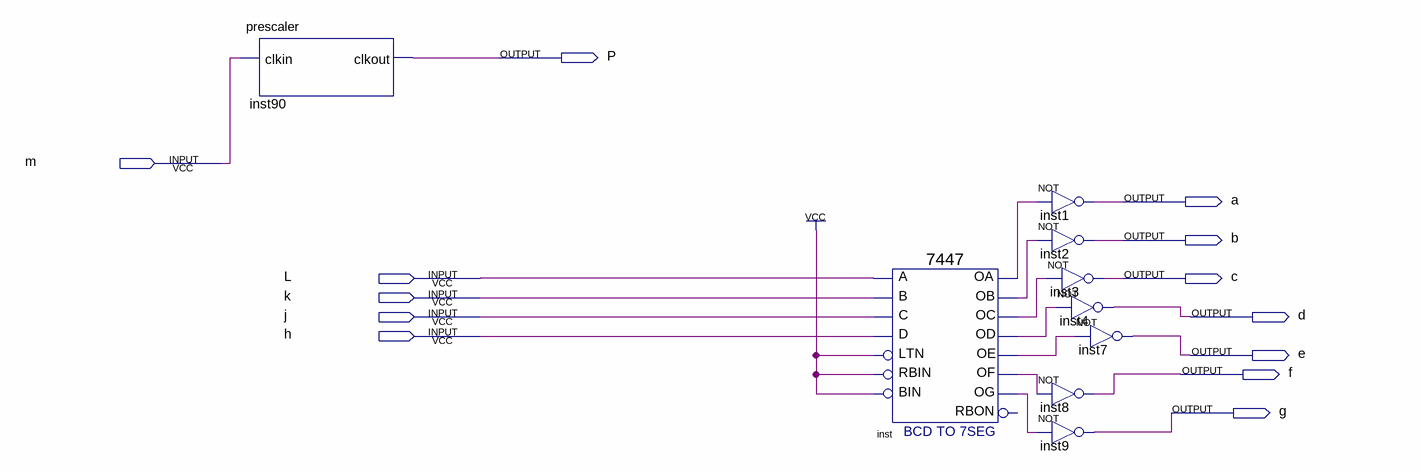
[diagram p0: schematic sheet]
// Quartus schematic firstask.bdf as structural Verilog: 9 symbols, 13 pins
module firstask (
  input  m,
  input  L,
  input  k,
  input  j,
  input  h,
  output P,
  output a,
  output b,
  output c,
  output d,
  output e,
  output f,
  output g
);

  wire inst_oa, inst_ob, inst_oc, inst_od, inst_oe, inst_of, inst_og;

  prescaler inst90 (.clkin(m), .clkout(P));
  \7447  inst (
    .LTN(1'b1), .B(k), .C(j), .D(h), .RBIN(1'b1), .BIN(1'b1), .A(L), .OB(inst_ob), .OC(inst_oc),
    .OE(inst_oe), .OD(inst_od), .OF(inst_of), .OG(inst_og), .OA(inst_oa));  // open: RBON
  not inst1 (a, inst_oa);
  not inst2 (b, inst_ob);
  not inst3 (c, inst_oc);
  not inst4 (d, inst_od);
  not inst7 (e, inst_oe);
  not inst8 (f, inst_of);
  not inst9 (g, inst_og);
endmodule
